# EAGLE design with direction (EAGLE 6.5.0)
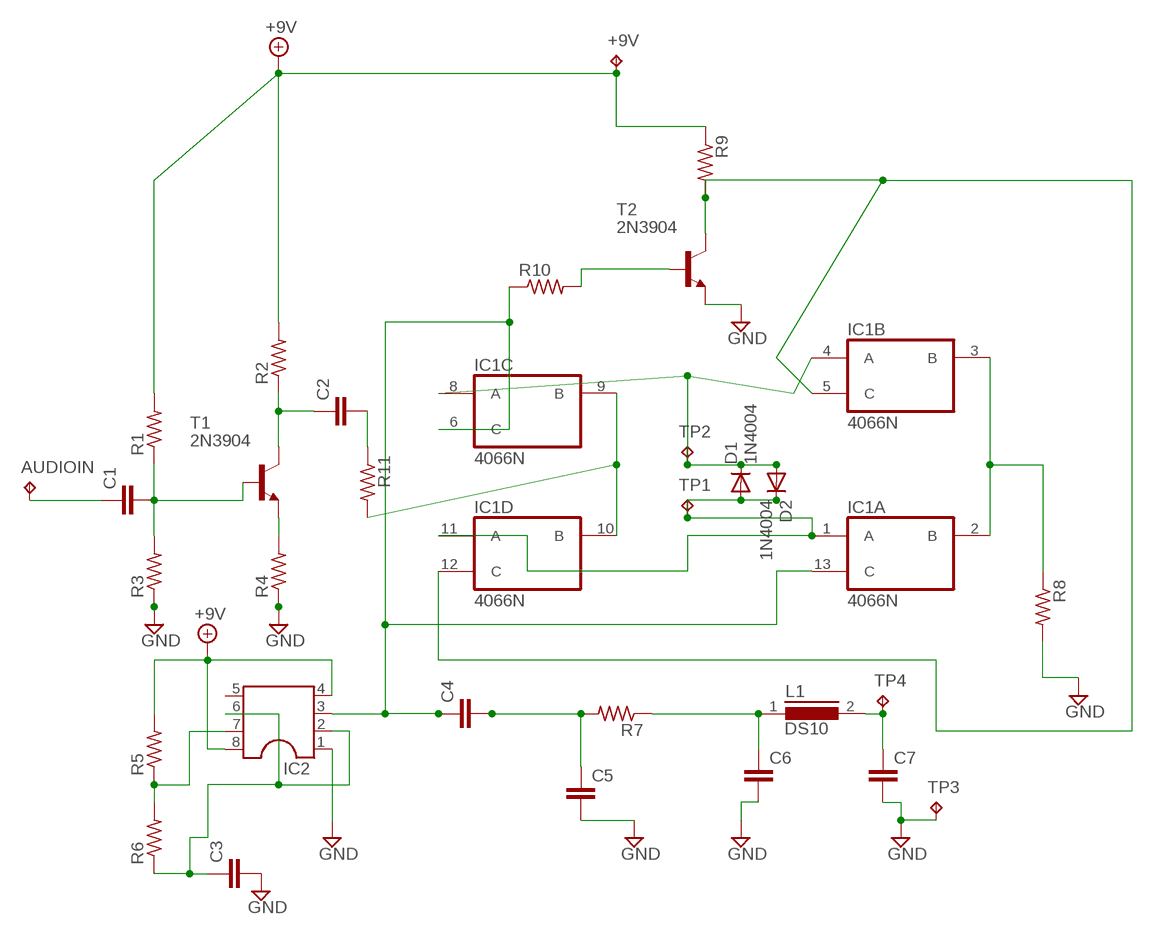
[diagram p0: schematic, sheet 1]

## Parts
+9V  TPPAD1-17  [P1-17]
AUDIOIN  TPPAD1-17  [P1-17]
C1  C10/5  [C10B5]
C2  C10/5  [C10B5]
C3  C5/2.5  [C5B2.5]
C4  C5/2.5  [C5B2.5]
C5  C5/3  [C5B3]
C6  C5/3  [C5B3]
C7  C10/5  [C10B5]
D1  1N4004  [DO41-10]
D2  1N4004  [DO41-10]
IC1  4066N  [DIL14]
IC2  DIL8S  [SOCKET-08]
L1  DS10  [DS10]
R1  R-US_0207/10  [0207/10]
R2  R-US_0207/10  [0207/10]
R3  R-US_0207/10  [0207/10]
R4  R-US_0207/10  [0207/10]
R5  R-US_0207/10  [0207/10]
R6  R-US_0207/10  [0207/10]
R7  R-US_0207/10  [0207/10]
R8  R-US_0207/10  [0207/10]
R9  R-US_0207/15  [0207/15]
R10  R-US_0207/10  [0207/10]
R11  R-US_0207/15  [0207/15]
T1  2N3904  [TO92]
T2  2N3904  [TO92]
TP1  TPPAD1-17  [P1-17]
TP2  TPPAD1-17  [P1-17]
TP3  TPPAD1-17Y  [P1-17Y]
TP4  TPPAD1-17Y  [P1-17Y]

## Nets
+9V: +9V.TP IC2.4 IC2.8 R1.2 R2.2 R5.2 R9.1
N$1: AUDIOIN.TP C1.1
N$2: C1.2 R1.1 R3.2 T1.2(B)
N$3: C2.1 R2.1 T1.1(C)
N$5: IC1.5(B:C) IC1.12(D:C) R9.2 T2.1(C)
N$6: R10.2 T2.2(B)
N$7: C4.1 IC1.6(C:C) IC1.13(A:C) IC2.3 R10.1
N$8: D1.C D2.A IC1.4(B:A) IC1.8(C:A) TP2.TP
N$9: D1.A D2.C IC1.1(A:A) IC1.11(D:A) TP1.TP
N$10: IC1.9(C:B) IC1.10(D:B) R11.2
N$11: C2.2 R11.1
N$12: IC1.2(A:B) IC1.3(B:B) R8.1
N$13: C6.1 L1.1 R7.1
N$14: C7.1 L1.2 TP4.TP
N$15: R4.2 T1.3(E)
N$16: C4.2 C5.1 R7.2
N$18: IC2.7 R5.1 R6.2
N$19: C3.1 IC2.2 IC2.6 R6.1
VSS: C3.2 C5.2 C6.2 C7.2 IC2.1 R3.1 R4.1 R8.2 T2.3(E) TP3.TP ; supply symbol labelled GND
Unconnected: IC2.5

## Power pins joined to a net without a drawn wire
+9V: IC1.14(P:VDD)
VSS: IC1.7(P:VSS)

## Library data of the parts
+9V AUDIOIN TP1-TP4 = testpad:TP: Test pad
C1-C7 = capacitor-wima:C: CAPACITOR naming: grid - package width
D1 D2 = diode:1N4004: DIODE general purpose rectifier, 1 A
IC1 = 40xx:4066: Quad bilateral ANALOG SWITCH
IC2 = ic-package:DIL8: Dual In Line / Socket
L1 = inductors:DS10: INDUCTOR
R1-R11 = resistor:R-US_: RESISTOR, American symbol
T1 T2 = transistor:2N3904: NPN TRANSISTOR

## Board
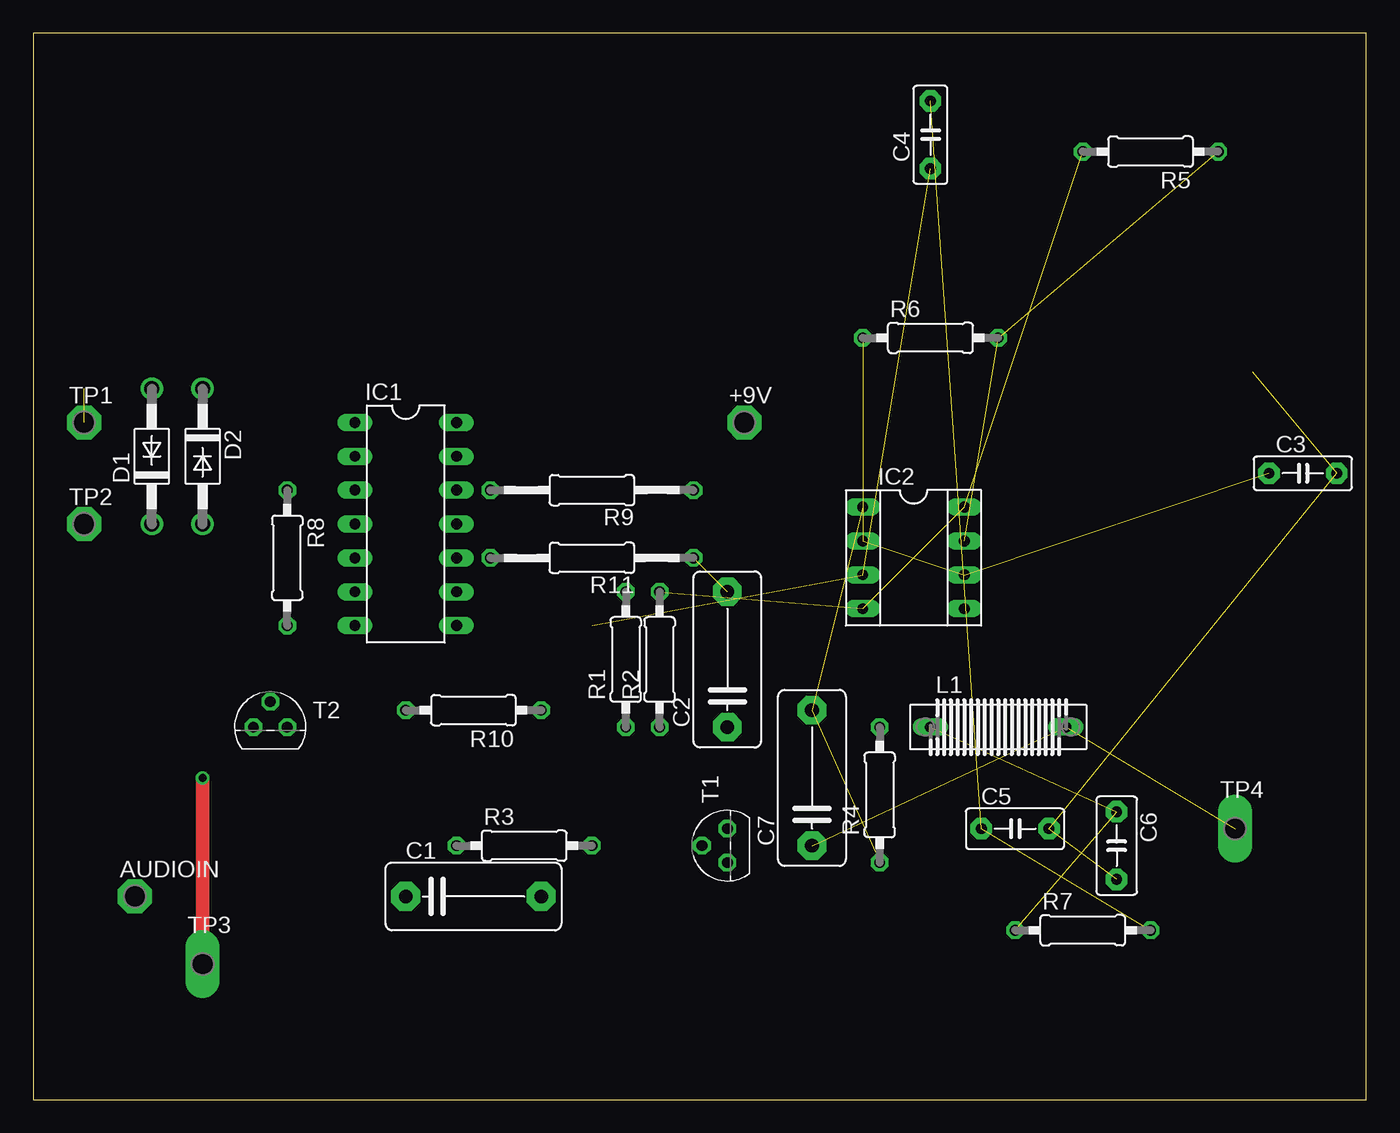
[diagram p1: board, top side]
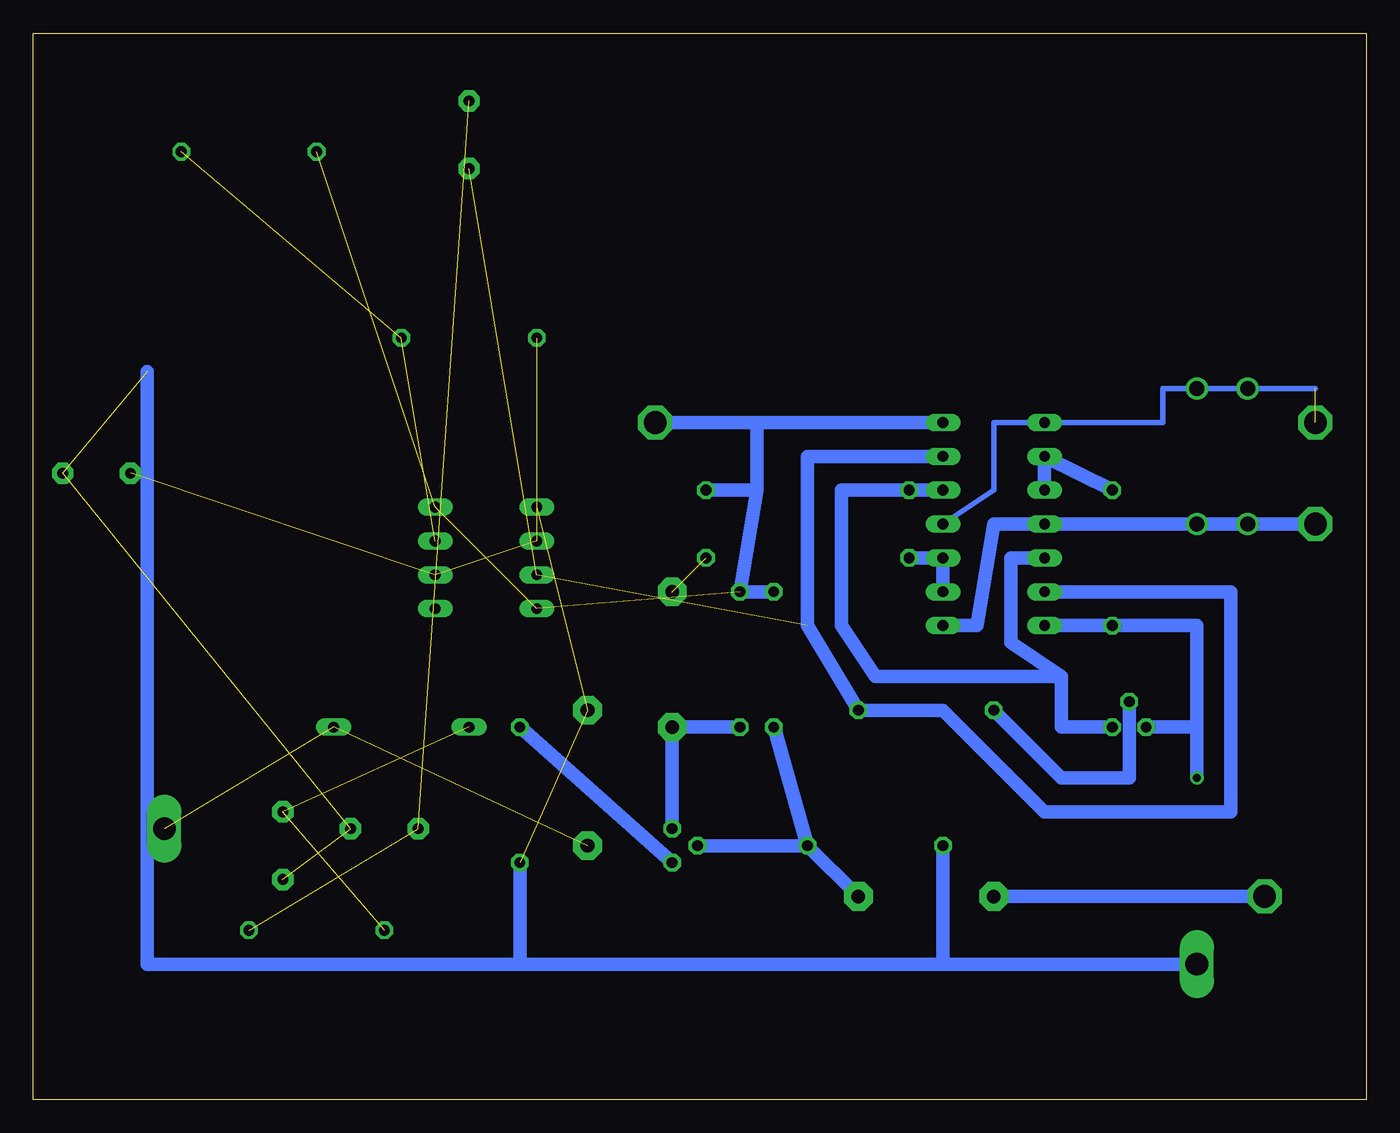
[diagram p2: board, bottom side, seen from below]

Size 100 x 80 mm. Coordinates in mm from the lower left corner, seen from the top.
Outline: 0,0 100,0 100,80 0,80 0,0
Copper layers (1*16): Top 0.035mm / dielectric 1.5mm / Bottom 0.035mm
Design rules "default": minimum track width 10mil, minimum drill 24mil, track to track 8mil, track to pad 8mil, pad to pad 8mil, via to via 8mil, smd to smd 8mil, copper to edge 40mil, drill to drill 8mil, minimum pad ring 10mil, minimum via ring 8mil, stop-mask expansion 4mil, vias tented up to drill 0mil, thermal gap 10mil

### Footprints (pad centres in the part's own frame; a part is rotated, then mirrored left to right if it is on the bottom)
P1-17 = drill 1.702 pad 2.54 octagon: TP 0,0
C10B5 = drill 1.016 pad 2.159 octagon: 1 -5.08,0; 2 5.08,0
C5B2.5 = drill 0.813 pad 1.6 octagon: 1 -2.54,0; 2 2.54,0
C5B3 = drill 0.813 pad 1.6 octagon: 1 -2.54,0; 2 2.54,0
DO41-10 = drill 1.118: A 5.08,0; C -5.08,0
DIL14 = drill 0.813 long: 1 -7.62,-3.81; 2 -5.08,-3.81; 3 -2.54,-3.81; 4 0,-3.81; 5 2.54,-3.81; 6 5.08,-3.81; 7 7.62,-3.81; 8 7.62,3.81; 9 5.08,3.81; 10 2.54,3.81; 11 0,3.81; 12 -2.54,3.81; 13 -5.08,3.81; 14 -7.62,3.81
SOCKET-08 = drill 0.813 long: 1 -3.81,-3.81; 2 -1.27,-3.81; 3 1.27,-3.81; 4 3.81,-3.81; 5 3.81,3.81; 6 1.27,3.81; 7 -1.27,3.81; 8 -3.81,3.81
DS10 = drill 0.813 long: 1 -5.08,0; 2 5.08,0
0207/10 = drill 0.813 octagon: 1 -5.08,0; 2 5.08,0
0207/15 = drill 0.813 octagon: 1 -7.62,0; 2 7.62,0
TO92 = drill 0.813 octagon: 1 1.27,0; 2 0,1.905; 3 -1.27,0
P1-17Y = drill 1.702 pad 2.121 long: TP 0,0

### Placement (x,y rotation side)
+9V  53.34,50.8 0 top
AUDIOIN  7.62,15.24 0 top
C1  33.02,15.24 0 top
C2  52.07,33.02 90 top
C3  95.25,46.99 0 top
C4  67.31,72.39 90 top
C5  73.66,20.32 0 top
C6  81.28,19.05 270 top
C7  58.42,24.13 90 top
D1  8.89,48.26 90 top
D2  12.7,48.26 270 top
IC1  27.94,43.18 270 top
IC2  66.04,40.64 270 top
L1  72.39,27.94 0 top
R1  44.45,33.02 90 top
R2  46.99,33.02 90 top
R3  36.83,19.05 0 top
R4  63.5,22.86 90 top
R5  83.82,71.12 180 top
R6  67.31,57.15 0 top
R7  78.74,12.7 0 top
R8  19.05,40.64 270 top
R9  41.91,45.72 180 top
R10  33.02,29.21 180 top
R11  41.91,40.64 180 top
T1  52.07,19.05 90 top
T2  17.78,27.94 0 top
TP1  3.81,50.8 0 top
TP2  3.81,43.18 0 top
TP3  12.7,10.16 0 top
TP4  90.17,20.32 0 top

### Tracks (layer width: path | path; a pad name or v marks a point on that pad's centre or on a via)
+9V  (3 unrouted)
  Bottom 1.016: R9.1 45.72,45.72 | 45.72,45.72 45.72,50.8 | 45.72,50.8 +9V.TP | 45.72,45.72 R2.2 R1.2 | 45.72,50.8 IC1.14
N$1
  Bottom 1.016: C1.1 AUDIOIN.TP
N$2
  Bottom 1.016: R3.2 C1.2 | R1.1 R3.2 | T1.2 R3.2
N$3
  Bottom 1.016: T1.1 C2.1 R2.1
N$5
  Bottom 1.016: T2.1 22.86,27.94 22.86,31.75 | IC1.5 26.67,40.64 26.67,34.29 22.86,31.75 | R9.2 IC1.12 39.37,45.72 39.37,35.56 36.83,31.75 22.86,31.75
N$6
  Bottom 1.016: T2.2 17.78,24.13 22.86,24.13 R10.2
N$7  (2 unrouted)
  Bottom 1.016: IC1.6 10.16,38.1 10.16,21.59 24.13,21.59 31.75,29.21 R10.1 41.91,35.56 41.91,48.26 IC1.13
N$8
  Bottom 1.016: TP2.TP D1.C D2.A IC1.4 27.94,43.18 29.21,35.56 IC1.8
N$9  (1 unrouted)
  Bottom 0.406: 3.81,53.34 D1.A D2.C 15.24,53.34 15.24,50.8 IC1.1 27.94,50.8 27.94,45.72 IC1.11
N$10
  Bottom 1.016: IC1.9 IC1.10 R11.2
N$11  (1 unrouted)
N$12
  Bottom 1.016: R8.1 IC1.2 IC1.3
N$13  (2 unrouted)
N$14  (2 unrouted)
N$15
  Bottom 1.016: T1.3 R4.2
N$16  (2 unrouted)
N$18  (2 unrouted)
N$19  (3 unrouted)
VSS  (via drill 0.6)  (5 unrouted)
  Top 1.016: TP3.TP v12.7,24.13
  Bottom 1.016: 12.7,27.94 12.7,35.56 R8.2 IC1.7 | 12.7,27.94 T2.3 | 12.7,27.94 v12.7,24.13 | 31.75,10.16 TP3.TP | R3.1 31.75,10.16 | 31.75,10.16 63.5,10.16 | 63.5,10.16 91.44,10.16 91.44,54.61 | R4.1 63.5,10.16